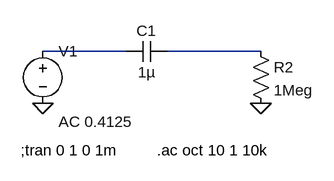
[diagram p0: schematic phototransistor-coupling.asc]
phototransistor-coupling.asc, the LTspice schematic file:
Version 4
SHEET 1 880 680
WIRE 160 -48 32 -48
WIRE 368 -48 224 -48
FLAG 32 32 0
FLAG 368 32 0
SYMBOL cap 224 -64 R90
WINDOW 0 0 32 VBottom 2
WINDOW 3 32 32 VTop 2
SYMATTR InstName C1
SYMATTR Value 1µ
SYMBOL voltage 32 -64 R0
WINDOW 123 24 124 Left 2
WINDOW 39 0 0 Left 2
SYMATTR InstName V1
SYMATTR Value ""
SYMATTR Value2 AC 0.4125
SYMBOL res 352 -64 R0
SYMATTR InstName R2
SYMATTR Value 1Meg
TEXT -2 104 Left 2 !;tran 0 1 0 1m
TEXT 208 104 Left 2 !.ac oct 10 1 10k

The netlist it stands for:
* phototransistor-coupling.asc
C1 N002 N001 1µ
V1 N001 0 AC 0.4125
R2 N002 0 1Meg
;tran 0 1 0 1m
.ac oct 10 1 10k
.backanno
.end